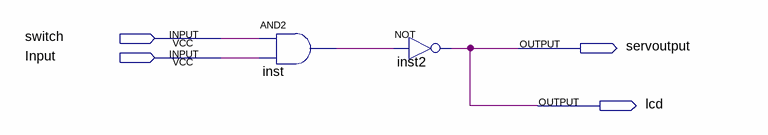
[diagram p0: schematic sheet]
// Quartus schematic su.bdf as structural Verilog: 2 symbols, 4 pins
module su (
  input  switch,
  input  Input,
  output servoutput,
  output lcd
);

  wire inst_out;

  and inst (inst_out, switch, Input);
  not inst2 (lcd, inst_out);

  assign servoutput = lcd;
endmodule
